# EAGLE design LCD-Touch-Exp (EAGLE 9.3.0)
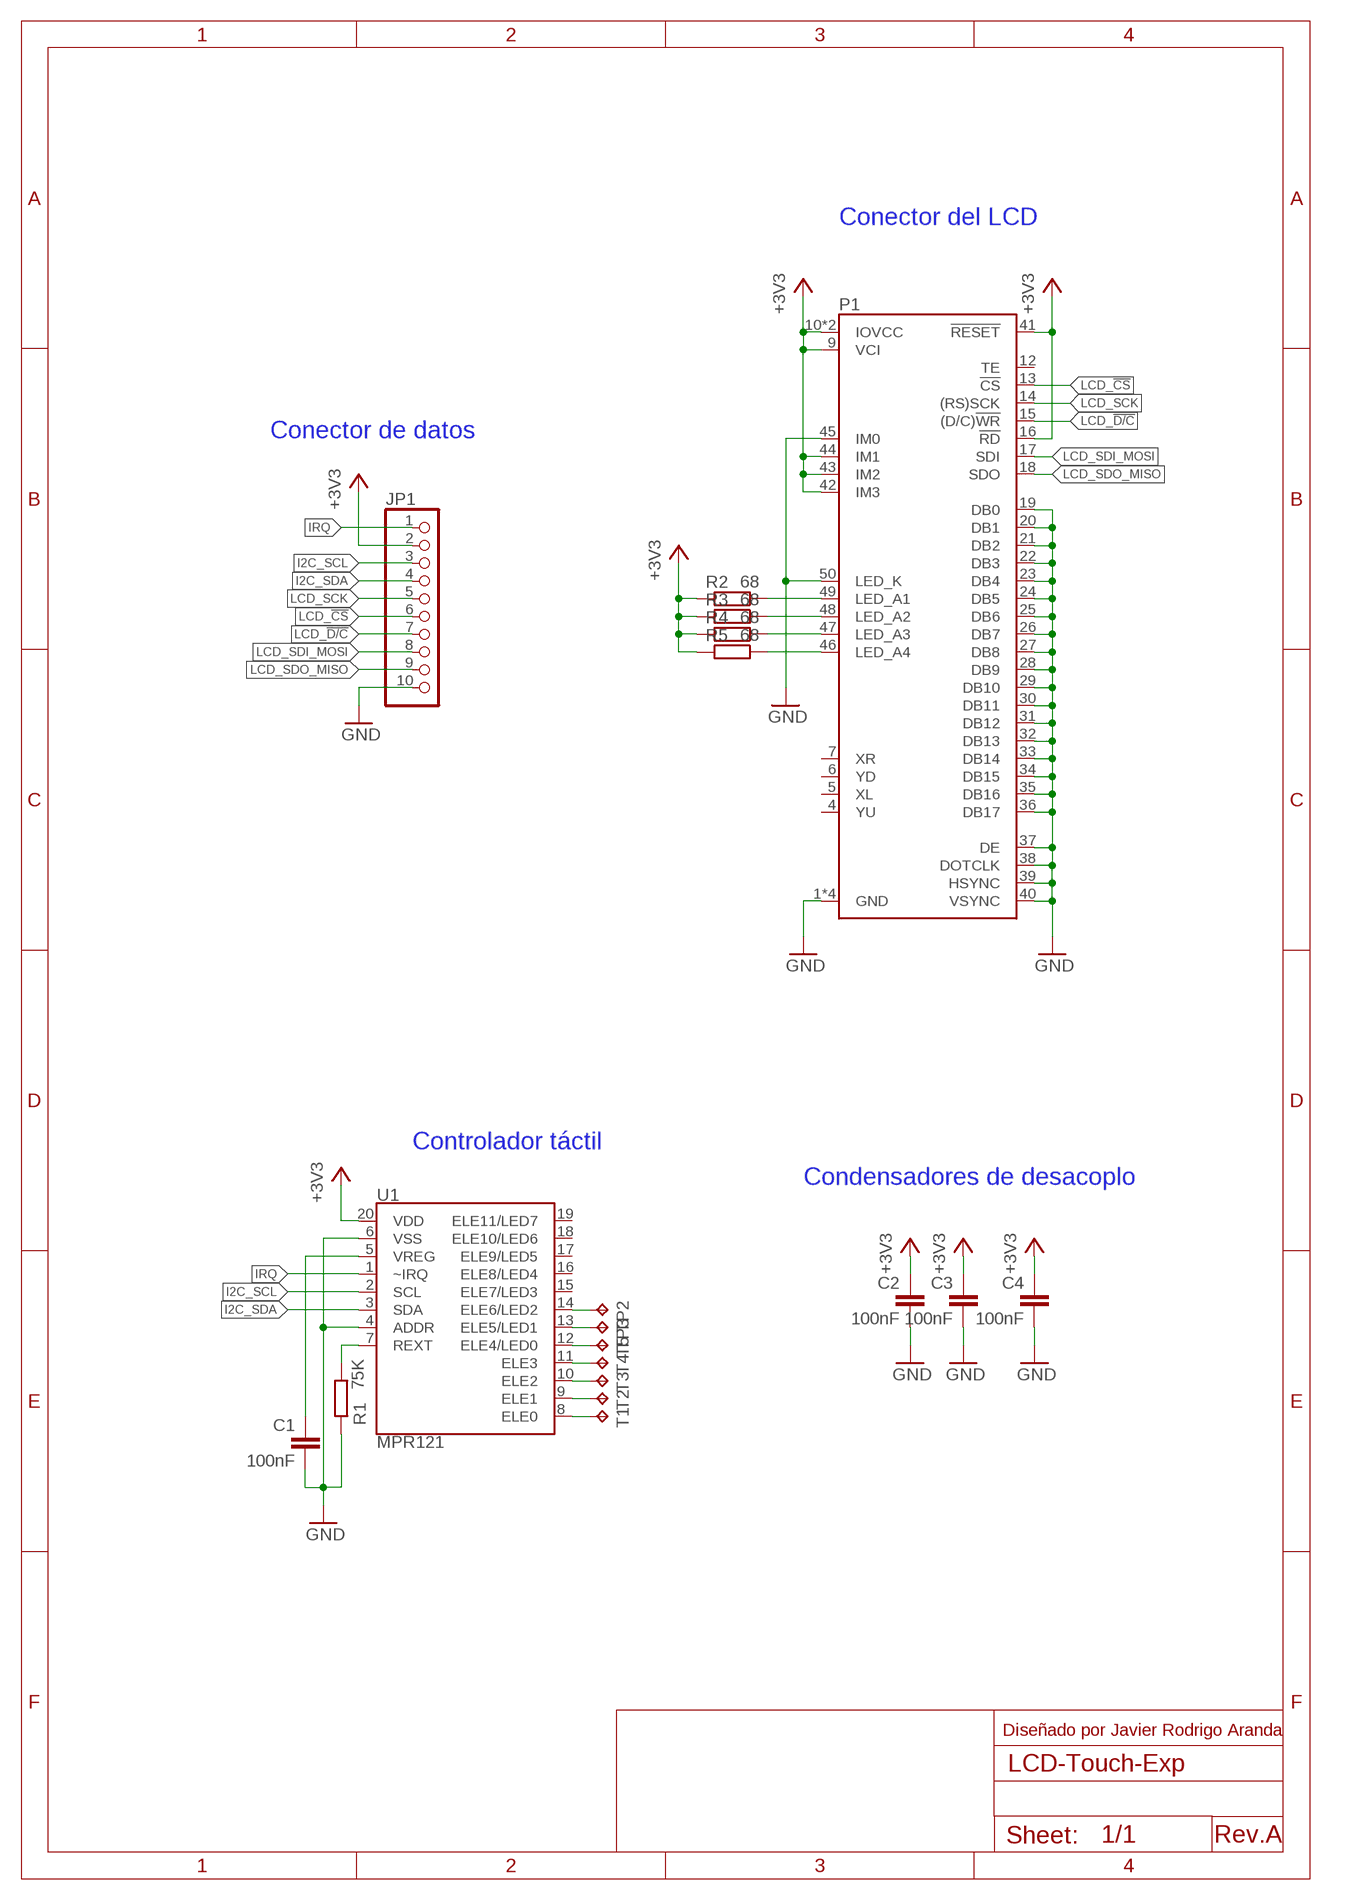
[diagram p0: schematic, sheet 1]

## Parts
C1  100nF  C-EUC0805  [C0805]
C2  100nF  C-EUC0805  [C0805]
C3  100nF  C-EUC0805  [C0805]
C4  100nF  C-EUC0805  [C0805]
JP1  HEADER-1X10SMT  [1X10_SMT]
P1  LCD_ILI9341180º  [FPC-50P-0.5MM]
R1  75K  R-EU_R0805  [R0805]
R2  68  R-EU_R0603  [R0603]
R3  68  R-EU_R0603  [R0603]
R4  68  R-EU_R0603  [R0603]
R5  68  R-EU_R0603  [R0603]
T1  TPB1,27  [B1,27]
T2  TPB1,27  [B1,27]
T3  TPB1,27  [B1,27]
T4  TPB1,27  [B1,27]
T5  TPB1,27  [B1,27]
TP2  TPB1,27  [B1,27]
TP3  TPB1,27  [B1,27]
U1  MPR121  [QFN-20]

## Nets
+3V3: C2.1 C3.1 C4.1 JP1.2 P1.9(VCI) P1.10(IOVCC) P1.11(IOVCC) P1.16(!RD) P1.41(!RESET) P1.42(IM3) P1.43(IM2) P1.44(IM1) R2.2 R3.2 R4.2 R5.2 U1.20(VDD)
GND: C1.2 C2.2 C3.2 C4.2 JP1.10 P1.1(GND) P1.2(GND) P1.3(GND) P1.8(GND) P1.19(DB0) P1.20(DB1) P1.21(DB2) P1.22(DB3) P1.23(DB4) P1.24(DB5) P1.25(DB6) P1.26(DB7) P1.27(DB8) P1.28(DB9) P1.29(DB10) P1.30(DB11) P1.31(DB12) P1.32(DB13) P1.33(DB14) P1.34(DB15) P1.35(DB16) P1.36(DB17) P1.37(DE) P1.38(DOTCLK) P1.39(HSYNC) P1.40(VSYNC) P1.45(IM0) P1.50(LED_K) R1.1 U1.4(ADDR) U1.6(VSS)
I2C_SCL: JP1.3 U1.2(SCL)
I2C_SDA: JP1.4 U1.3(SDA)
IRQ: JP1.1 U1.1(~IRQ)
LCD_!CS: JP1.6 P1.13(!CS)
LCD_!D/C: JP1.7 P1.15((D/C)!WR!)
LCD_SCK: JP1.5 P1.14((RS)SCK)
LCD_SDI_MOSI: JP1.8 P1.17(SDI)
LCD_SDO_MISO: JP1.9 P1.18(SDO)
N$1: R1.2 U1.7(REXT)
N$2: T1.TP U1.8(ELE0)
N$3: T2.TP U1.9(ELE1)
N$4: T3.TP U1.10(ELE2)
N$5: T4.TP U1.11(ELE3)
N$6: T5.TP U1.12(ELE4/LED0)
N$7: TP3.TP U1.13(ELE5/LED1)
N$8: TP2.TP U1.14(ELE6/LED2)
N$18: P1.49(LED_A1) R2.1
N$19: P1.48(LED_A2) R3.1
N$20: P1.47(LED_A3) R4.1
N$21: P1.46(LED_A4) R5.1
N$25: C1.1 U1.5(VREG)
Unconnected: P1.4(YU) P1.5(XL) P1.6(YD) P1.7(XR) P1.12(TE) U1.15(ELE7/LED3) U1.16(ELE8/LED4) U1.17(ELE9/LED5) U1.18(ELE10/LED6) U1.19(ELE11/LED7)

## Notes on the sheet
- Conector del LCD
- Conector de datos
- Controlador táctil
- Condensadores de desacoplo
- Diseñado por Javier Rodrigo Aranda
- Rev.A

## Library data of the parts
C1-C4 = rcl:C-EU: CAPACITOR, European symbol; SPICEPREFIX: C
JP1 = microbuilder:HEADER-1X10: PIN HEADER
P1 = jrodrigo:LCD_ILI9341: 2.83" 240x320 Pixel Capacitive Touch Display
R1-R5 = rcl:R-EU_: RESISTOR, European symbol; SPICEPREFIX: R
T1-T5 TP2 TP3 = testpad:TP: Test pad
U1 = SparkFun-Sensors:MPR121: NXP MPR121 Proximity Capacitive Touch Sensor Controller The MPR121 is a capacitive touch sensor controller driven by an I2C interface. The chip can control up to twelve individual electrodes, as well as a simulated thirteenth electrode. The MPR121 also features eight LED driving pins. When these pins are not configured as electrodes, they may be used to drive LEDs. Datasheet <http://www.sparkfun.com/datasheets/Components/MPR121.pdf> SparkFun Products Capacitive Touch Sensor Controller - MPR121QR2 <https://www.sparkfun.com/products/9604> (COM-09604) SparkFun Capacitive Touch Sensor Breakout - MPR121 <https://www.sparkfun.com/products/9695> (SEN-09695) SparkFun Touch Shield <https://www.sparkfun.com/products/12013> (DEV-12013) SparkFun Capacitive Touch Keypad - MPR121 <https://www.sparkfun.com/products/12017> (SEN-12017); PROD_ID: IC-09490; SF_ID: COM-09604

## Board
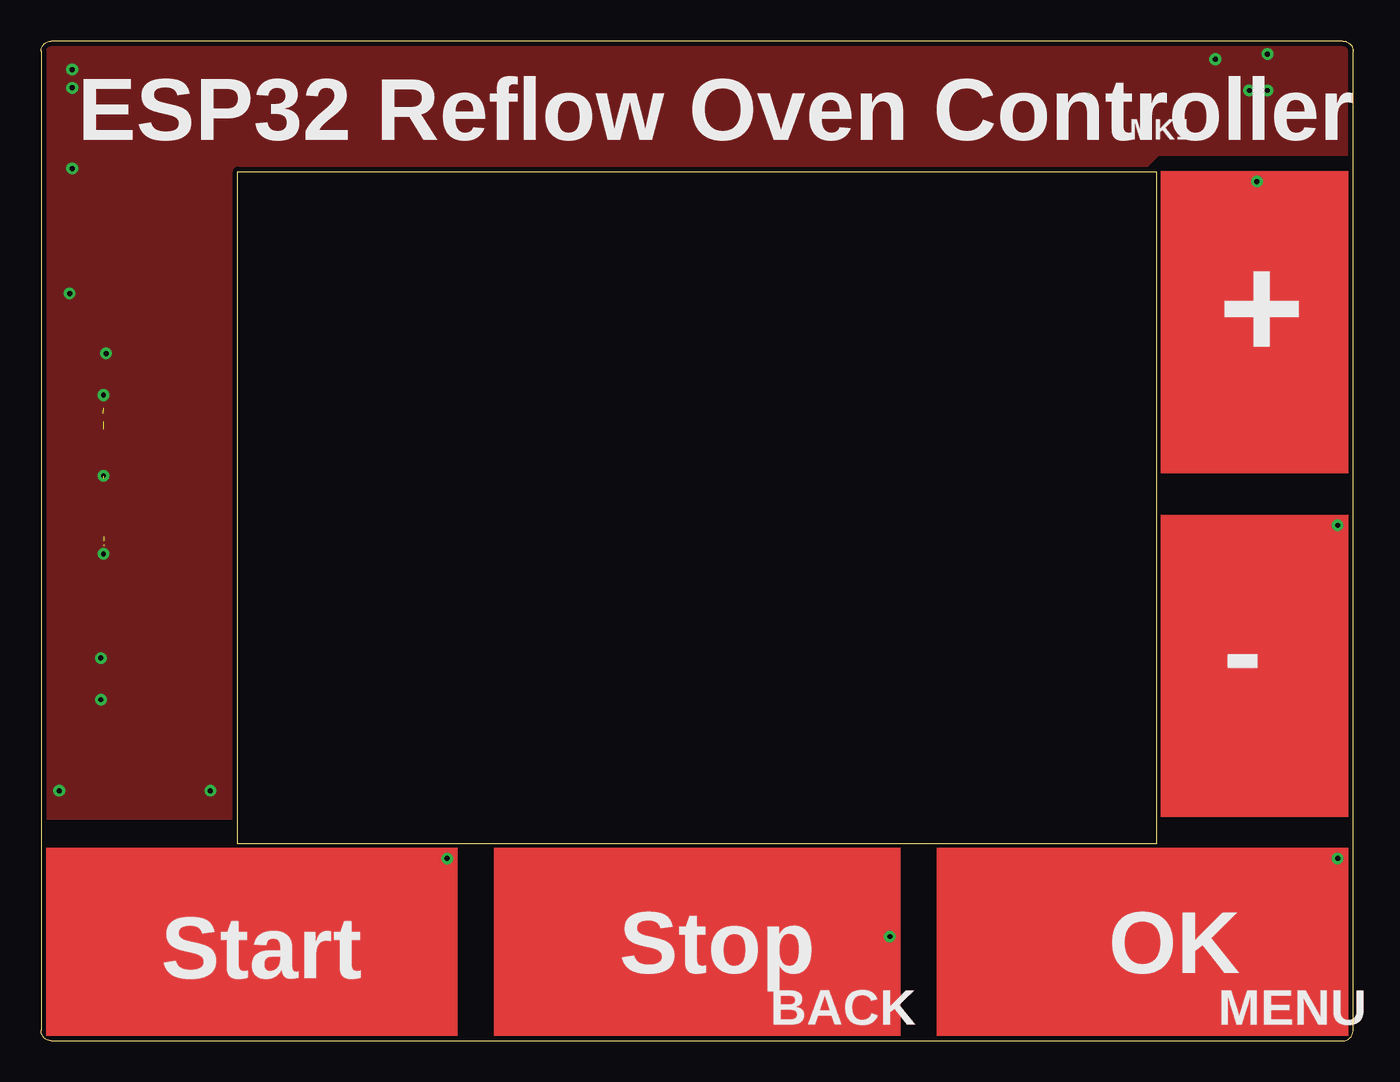
[diagram p1: board, top side]
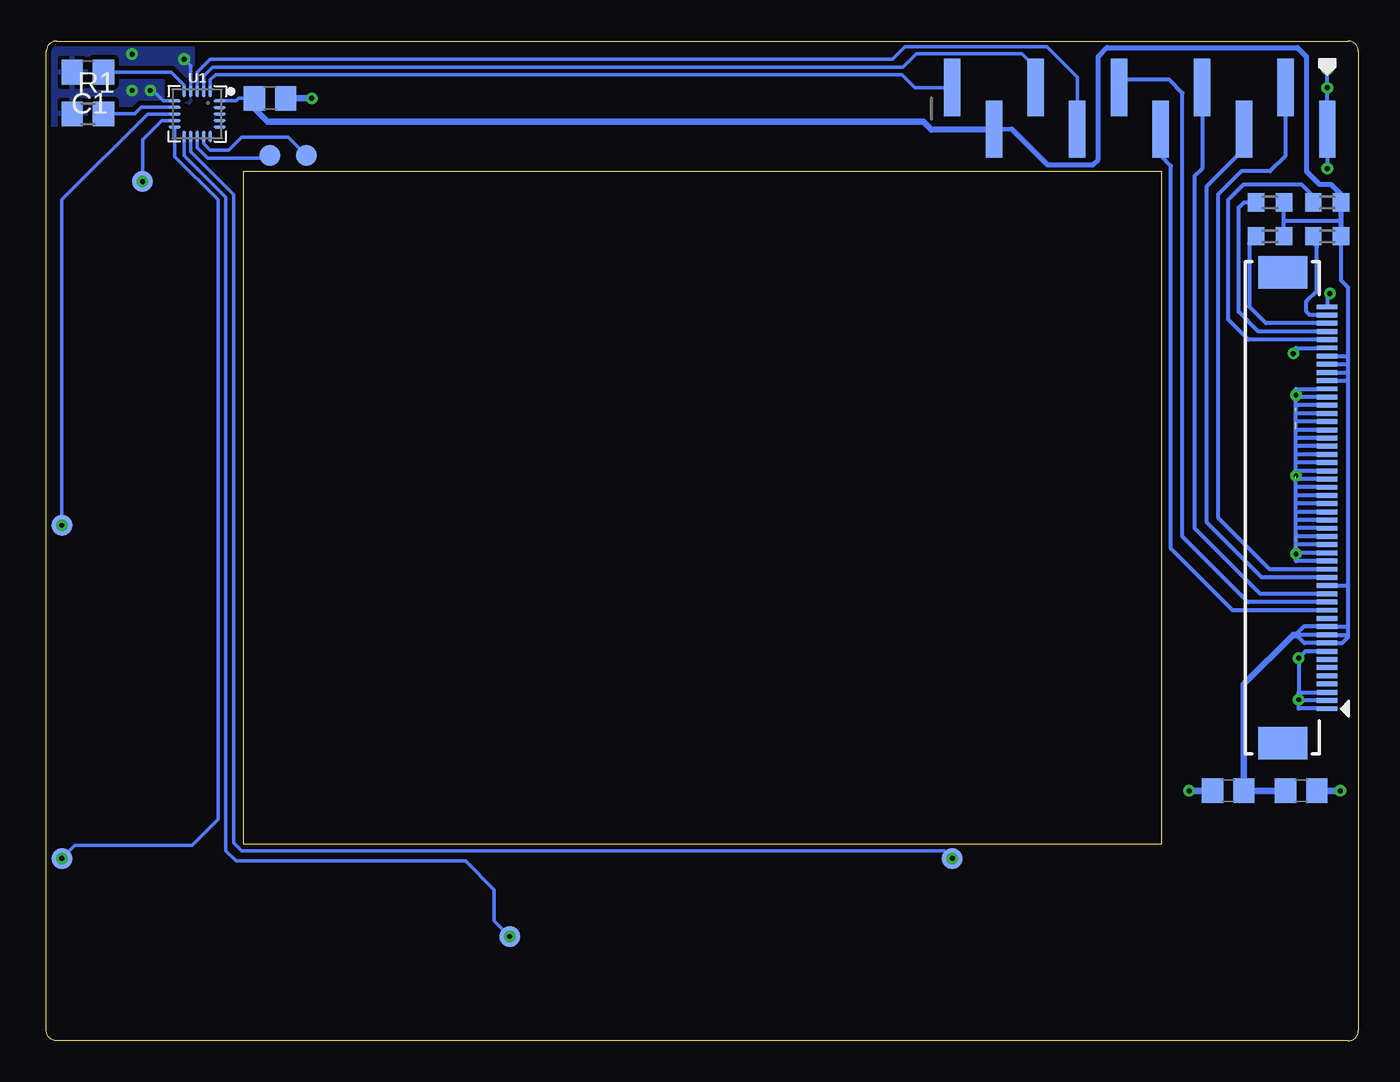
[diagram p2: board, bottom side, seen from below]

Size 80 x 60.96 mm. Coordinates in mm from the lower left corner, seen from the top.
Outline: 0.64,0 79.36,0 arc90 80,0.64 80,60.33 arc90 79.36,60.96 0.64,60.96 arc90 0,60.33 0,0.64 arc90 0.64,0
Outline: 12,12 12,53 68,53 68,12 12,12
Copper layers (1*16): Top 0.035mm / dielectric 1.5mm / Bottom 0.035mm
Design rules "Piwae_PCBway": minimum track width 4mil, minimum drill 6mil, track to track 8mil, track to pad 8mil, pad to pad 8mil, via to via 8mil, smd to smd 8mil, copper to edge 10mil, drill to drill 8mil, minimum pad ring 8mil, minimum via ring 8mil, stop-mask expansion 4mil, vias tented up to drill 25mil, thermal gap 10mil
bRestrict: 1 lines

### Footprints (pad centres in the part's own frame; a part is rotated, then mirrored left to right if it is on the bottom)
C0805 = smd 1.3 x 1.5: 1 -0.95,0; 2 0.95,0
1X10_SMT = smd 1 x 3.5: 1 -11.43,1.27; 2 -8.89,-1.27; 3 -6.35,1.27; 4 -3.81,-1.27; 5 -1.27,1.27; 6 1.27,-1.27; 7 3.81,1.27; 8 6.35,-1.27; 9 8.89,1.27; 10 11.43,-1.27
FPC-50P-0.5MM = smd 0.3 x 1.25: 1 12.25,0; 2 11.75,0; 3 11.25,0; 4 10.75,0; 5 10.25,0; 6 9.75,0; 7 9.25,0; 8 8.75,0; 9 8.25,0; 10 7.75,0; 11 7.25,0; 12 6.75,0; 13 6.25,0; 14 5.75,0; 15 5.25,0; 16 4.75,0; 17 4.25,0; 18 3.75,0; 19 3.25,0; 20 2.75,0; 21 2.25,0; 22 1.75,0; 23 1.25,0; 24 0.75,0; 25 0.25,0; 26 -0.25,0; 27 -0.75,0; 28 -1.25,0; 29 -1.75,0; 30 -2.25,0; 31 -2.75,0; 32 -3.25,0; 33 -3.75,0; 34 -4.25,0; 35 -4.75,0; 36 -5.25,0; 37 -5.75,0; 38 -6.25,0; 39 -6.75,0; 40 -7.25,0; 41 -7.75,0; 42 -8.25,0; 43 -8.75,0; 44 -9.25,0; 45 -9.75,0; 46 -10.25,0; 47 -10.75,0; 48 -11.25,0; 49 -11.75,0; 50 -12.25,0 | smd 2 x 3: P$1 -14.35,-2.71; P$2 14.35,-2.71
R0805 = smd 1.3 x 1.5: 1 -0.95,0; 2 0.95,0
R0603 = smd 1 x 1.1: 1 -0.85,0; 2 0.85,0
B1,27 = smd 1.27 x 1.27: TP 0,0
QFN-20 = smd 0.75 x 0.195: 1 -1.367,0.8; 2 -1.367,0.4; 3 -1.367,0; 4 -1.367,-0.4; 5 -1.367,-0.8; 11 1.375,-0.8; 12 1.375,-0.4; 13 1.375,0; 14 1.375,0.4; 15 1.375,0.8 | smd 0.195 x 0.75: 6 -0.795,-1.372; 7 -0.395,-1.372; 8 0.005,-1.372; 9 0.405,-1.372; 10 0.805,-1.372; 16 0.81,1.372; 17 0.41,1.372; 18 0.01,1.372; 19 -0.39,1.372; 20 -0.79,1.372

### Placement (x,y rotation side)
C1  77.47,59.05 180 bottom
C2  66.36,57.47 0 bottom
C3  3.49,15.24 0 bottom
C4  7.94,15.24 180 bottom
JP1  13.34,56.85 0 bottom
P1  1.91,32.5 270 bottom
R1  77.47,56.52 0 bottom
R2  1.91,49.05 0 bottom
R3  5.4,49.05 0 bottom
R4  5.4,51.12 0 bottom
R5  1.91,51.12 0 bottom
T1  79.06,31.43 0 bottom
T2  74.14,52.39 0 bottom
T3  79.06,11.11 0 bottom
T4  51.75,6.35 0 bottom
T5  24.77,11.11 0 bottom
TP2  64.14,53.98 0 bottom
TP3  66.36,53.98 0 bottom
U1  70.8,56.52 270 bottom

### Tracks (layer width: path | path; a pad name or v marks a point on that pad's centre or on a via)
+3V3
  Bottom 0.203: U1.20 68.42,57.3 68.26,57.47 C2.1
  Bottom 0.254: 3.79,24.75 3.29,24.25 P1.9 0.99,24.25 0.64,24.61 0.64,24.77 | 3.79,24.75 3.65,24.75 P1.10 0.65,24.75 0.64,24.77 | 3.79,24.75 3.81,24.77 3.33,25.25 P1.11 0.64,25.25 0.64,25.24 | 0.64,24.77 0.64,25.24 | 0.64,25.24 0.64,27.78 | 0.64,27.78 0.64,40.16 | 0.64,40.16 0.64,40.8 | 0.64,40.8 0.64,41.27 | 0.64,41.27 0.64,41.75 | P1.16 0.67,27.75 0.64,27.78 | P1.44 0.64,41.75 | P1.43 0.66,41.25 0.64,41.27 | P1.42 0.68,40.75 0.64,40.8 | P1.41 0.72,40.25 0.64,40.16 | R2.2 1.05,46.35 0.64,45.94 0.64,41.75 | R3.2 4.55,50.01 | 4.55,50.01 R4.2 | 4.55,50.01 1.05,50.01
  Bottom 0.305: JP1.2 21.16,55.61 18.96,53.41 16.19,53.41 15.88,53.72 15.88,60.01 15.33,60.55 3.72,60.55 3.17,60.01 3.17,53.02 2.38,52.23 1.69,52.23 1.05,51.59 R5.2 1.05,50.01 R2.2
  Bottom 0.406: C2.1 67.31,56.83 66.52,56.04 26.51,56.04 26.04,55.56 JP1.2 | 3.65,24.75 3.98,24.75 6.99,21.75 C4.1 C3.1
GND  (via drill 0.3)  (5 unrouted)
  Bottom 0.203: U1.6 72.87,57.31 73.5,57.94 v73.66,57.94 | U1.4 71.2,59.45 v71.6,59.85
  Bottom 0.254: v1.91,59.21 v1.91,58.1 JP1.10 v1.91,53.18 | 3.65,21.25 P1.3 | P1.1 3.65,20.25 3.65,20.75 | 3.65,21.25 v3.65,20.8 3.65,20.75 | P1.2 3.65,20.75 | P1.45 3.81,42.25 3.97,42.09 v3.97,41.91 | P1.40 3.81,39.75 3.81,39.25 | P1.19 3.81,29.25 v3.81,29.69 | 3.81,32.25 3.81,32.75 | 3.81,32.75 3.81,33.25 | 3.81,34.75 3.81,35.25 | P1.20 3.81,29.75 | 3.81,29.75 3.81,30.16 3.81,31.25 | P1.21 3.81,30.25 3.81,30.48 | P1.22 3.81,30.75 3.81,30.96 | P1.23 3.81,31.25 | 3.81,31.25 3.81,31.75 | P1.24 3.81,31.75 | 3.81,31.75 3.81,32.25 | P1.25 3.81,32.25 | P1.26 3.81,32.75 | P1.27 3.81,33.25 | 3.81,33.25 3.81,33.75 | P1.28 3.81,33.75 | 3.81,33.75 3.81,34.75 | P1.29 3.81,34.25 3.81,34.29 | P1.30 3.81,34.75 | P1.31 3.81,35.25 | 3.81,35.25 3.81,35.75 | P1.32 3.81,35.75 | 3.81,35.75 3.81,36.25 | P1.33 3.81,36.25 | 3.81,36.25 3.81,36.75 | P1.34 3.81,36.75 | 3.81,36.75 3.81,37.75 | P1.35 3.81,37.25 3.81,37.31 | 3.81,37.75 3.81,38.26 | 3.81,38.26 3.81,39.25 | P1.38 3.81,38.75 3.81,38.58 | P1.39 3.81,39.25 | v1.75,45.56 1.91,45.4 P1.50 | P1.36 3.81,37.75 | P1.37 3.8,38.25 3.81,38.26 | P1.8 3.24,23.75 v3.65,23.34 3.65,21.25 | v3.81,29.69 3.81,29.75 | 3.81,29.75 v3.81,29.69
  Bottom 0.406: C2.2 v63.82,57.47 | v1.11,15.24 C3.2 | v10.32,15.24 C4.2
  other vias: 74.77,60.17 74.77,57.94 3.81,39.37 3.81,34.45
  pour Top (isolate 0.305): 0,13.65 12.06,13.65 12.06,53.02 66.99,53.02 68.1,54.13 80.01,54.13 80.01,60.96 0,60.96
  pour Bottom (isolate 0.305): 71.75,56.83 73.98,56.83 74.93,55.88 80.01,55.88 80.01,60.96 71.12,60.96 71.12,57.47
I2C_SCL
  Bottom 0.203: U1.2 70.4,58.82 69.85,59.37 27.78,59.37 26.96,60.2 20.51,60.2 19.68,59.37 JP1.3
I2C_SDA
  Bottom 0.203: U1.3 70.8,59.05 70.01,59.85 28.42,59.85 27.66,60.6 19.01,60.6 17.14,58.74 JP1.4
IRQ
  Bottom 0.203: U1.1 70,58.59 69.69,58.9 27.84,58.9 27.05,58.1 JP1.1
LCD_!CS
  Bottom 0.254: 12.06,53.98 11.43,53.34 11.43,30 7.68,26.25 P1.13
  Bottom 0.305: JP1.6 12.06,53.98
LCD_!D/C
  Bottom 0.254: JP1.7 9.53,53.18 10,52.7 10,31.27 5.98,27.25 P1.15
LCD_SCK
  Bottom 0.254: 14.61,58.62 11.58,58.62 10.73,57.78 10.73,30.74 6.75,26.75 P1.14
  Bottom 0.305: JP1.5 14.61,58.62
LCD_SDI_MOSI
  Bottom 0.254: P1.17 5.9,28.25 9.24,31.59 9.24,52.12 6.99,54.38 JP1.8
LCD_SDO_MISO
  Bottom 0.254: P1.18 5.41,28.75 8.57,31.91 8.57,51.59 7.14,53.02 5.4,53.02 4.45,53.98 JP1.9
N$1
  Bottom 0.203: U1.7 74.22,56.91 74.61,56.52 R1.2
N$2  (via drill 0.3)
  Bottom 0.203: T1.TP 79.06,51.28 73.82,56.51 U1.8
  other vias: 79.06,31.43
N$3  (via drill 0.3)
  Bottom 0.203: U1.9 72.95,56.11 74.14,54.93 T2.TP
  other vias: 74.14,52.39
N$4  (via drill 0.3)
  Bottom 0.203: U1.10 72.17,53.92 69.53,51.28 69.53,13.49 71.12,11.91 78.26,11.91 T3.TP
  other vias: 79.06,11.11
N$5  (via drill 0.3)
  Bottom 0.203: U1.11 71.6,53.98 69.06,51.44 69.06,11.59 68.42,10.95 54.45,10.95 52.7,9.21 52.7,7.3 T4.TP
  other vias: 51.75,6.35
N$6  (via drill 0.3)
  Top 0.203: T5.TP 24.92,11.11
  Bottom 0.203: U1.12 71.2,54.22 68.58,51.59 68.58,12.06 68.1,11.59 25.24,11.59 T5.TP
  other vias: 24.77,11.11
N$7
  Bottom 0.203: U1.13 70.8,54.45 70.17,53.82 66.52,53.82 TP3.TP
N$8
  Bottom 0.203: U1.14 70.4,54.69 70.01,54.29 68.9,54.29 68.1,55.09 65.25,55.09 TP2.TP
N$18
  Bottom 0.254: P1.49 2.98,44.25 3.17,44.45 3.17,45.09 2.54,45.72 2.54,48.42 2.52,48.44 2.75,48.64 R2.1
N$19
  Bottom 0.254: P1.48 5.65,43.75 6.67,44.77 6.67,48.63 R3.1
N$20
  Bottom 0.254: R4.1 6.99,51.12 7.3,50.8 7.3,44.45 6.1,43.25 P1.47
N$21
  Bottom 0.254: P1.46 6.71,42.75 7.94,43.97 7.94,51.28 6.99,52.23 3.49,52.23 2.75,51.49 R5.1
N$25
  Bottom 0.203: U1.5 71.6,58.27 72.39,59.05 C1.1
(copper drawn outside any net)
  shapes: Top area x5

### Text on the board
tNames: ESP32 Reflow Oven Controller | MK1 | + | - | Start | Stop | OK | BACK | MENU